# EAGLE design DFN-4_1.6x1.2_EP_Breakout (EAGLE 9.6.2)
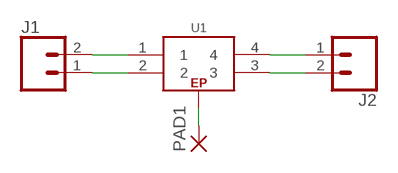
[diagram p0: schematic, sheet 1]

## Parts
J1  CONN_02  [1X02]
J2  CONN_02  [1X02]
PAD1  SMD2  [SMD1,27-2,54]
U1  GEN_4_EPTDFN_4  [TDFN_4]

## Nets
N$1: PAD1.1(P) U1.EP
N$2: J1.1 U1.2
N$3: J1.2 U1.1
N$4: J2.1 U1.4
N$5: J2.2 U1.3

## Library data of the parts
J1 J2 = bschulz:CONN_02: Genaric 2 terminal header SCREW_2.54 <https://www.digikey.com/product-detail/en/on-shore-technology-inc/OSTVN02A150/ED10561-ND/1588862> 39532_RA <https://www.digikey.com/product-detail/en/molex/0395321002/WM7845-ND/1280696>
PAD1 = bschulz:SMD2: SMD PAD; DIGIKEY: N/A; MF: N/A; MPN: DNP
U1 = bschulz:GEN_4_EP: Generic 4 Pin Package for Breakout Boards w/Exposed Pad

## Board
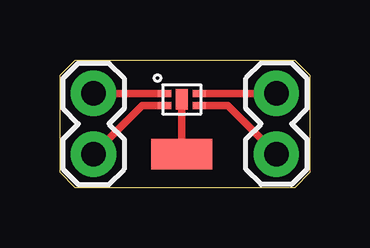
[diagram p1: board, top side]

Size 10.41 x 5.33 mm. Coordinates in mm from the lower left corner, seen from the top.
Outline: 9.78,0 0.64,0 0,0.64 0,4.7 0.64,5.33 9.78,5.33 10.41,4.7 10.41,0.64 9.78,0
Copper layers (1*16): Top 0.035559375mm / dielectric 1.6mm / Bottom 0.035559375mm
Design rules "oshpark-2layer": minimum track width 6mil, minimum drill 10mil, track to track 6mil, track to pad 6mil, pad to pad 6mil, via to via 6mil, smd to smd 6mil, copper to edge 15mil, drill to drill 6mil, minimum pad ring 5mil, minimum via ring 5mil, stop-mask expansion 2.5mil, vias tented up to drill 0mil, thermal gap 10mil

### Footprints (pad centres in the part's own frame; a part is rotated, then mirrored left to right if it is on the bottom)
1X02 = drill 1.016 pad 1.88: 1 0,0; 2 2.54,0
SMD1,27-2,54 = smd 1.27 x 2.54: 1 0,0
TDFN_4 = smd 0.55 x 0.3: 1 -0.725,0.25; 2 -0.725,-0.25; 3 0.725,-0.25; 4 0.725,0.25 | smd 0.5 x 0.86: EP 0,0

### Placement (x,y rotation side)
J1  1.4,1.4 90 top
J2  9.02,3.94 270 top
PAD1  5.08,1.4 90 top
U1  5.08,3.68 0 top

### Tracks (layer width: path | path; a pad name or v marks a point on that pad's centre or on a via)
N$1
  Top 0.305: U1.EP PAD1.1
N$2
  Top 0.305: U1.2 3.43,3.43 J1.1
N$3
  Top 0.305: U1.1 J1.2
N$4
  Top 0.305: U1.4 J2.1
N$5
  Top 0.305: U1.3 6.98,3.43 J2.2

### Text on the board
tDocu: 1 | 4 | EP | 2 | 3
bDocu: TDFN-4 | Break44 / B. Schulz